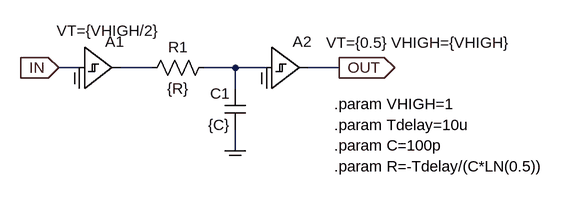
[diagram p0: schematic delayg2.asc]
delayg2.asc, the LTspice schematic file:
Version 4
SHEET 1 880 680
WIRE -128 272 -160 272
WIRE -16 272 -64 272
WIRE 112 272 64 272
WIRE 160 272 112 272
WIRE 272 272 224 272
WIRE 112 304 112 272
WIRE 112 400 112 368
FLAG -160 272 IN
IOPIN -160 272 In
FLAG 272 272 OUT
IOPIN 272 272 Out
FLAG 112 400 COM
IOPIN 112 400 BiDir
FLAG -128 288 COM
IOPIN -128 288 BiDir
FLAG 160 288 COM
IOPIN 160 288 BiDir
SYMBOL cap 128 368 R180
WINDOW 0 24 56 Left 2
WINDOW 3 24 8 Left 2
SYMATTR InstName C1
SYMATTR Value {C}
SYMBOL res 80 256 R90
WINDOW 0 0 56 VBottom 2
WINDOW 3 32 56 VTop 2
SYMATTR InstName R1
SYMATTR Value {R}
SYMBOL Digital\\schmtbuf -128 208 R0
WINDOW 3 -35 7 Left 2
SYMATTR Value VT={VHIGH/2}
SYMATTR InstName A1
SYMBOL Digital\\schmtbuf 160 208 R0
WINDOW 3 92 25 Left 2
SYMATTR Value VT={0.5} VHIGH={VHIGH}
SYMATTR InstName A2
TEXT 264 360 Left 2 !.param Tdelay=10u
TEXT 264 392 Left 2 !.param C=100p
TEXT 264 424 Left 2 !.param R=-Tdelay/(C*LN(0.5))
TEXT 264 328 Left 2 !.param VHIGH=1

The netlist it stands for:
* delayg2.asc
C1 COM N002 {C}
R1 N002 N001 {R}
A1 IN COM COM COM COM COM N001 COM SCHMITT VT={VHIGH/2}
A2 N002 COM COM COM COM COM OUT COM SCHMITT VT={0.5} VHIGH={VHIGH}
.param Tdelay=10u
.param C=100p
.param R=-Tdelay/(C*LN(0.5))
.param VHIGH=1
.backanno
.end